# Altium project Battery_4_mI_R2.PrjPcb
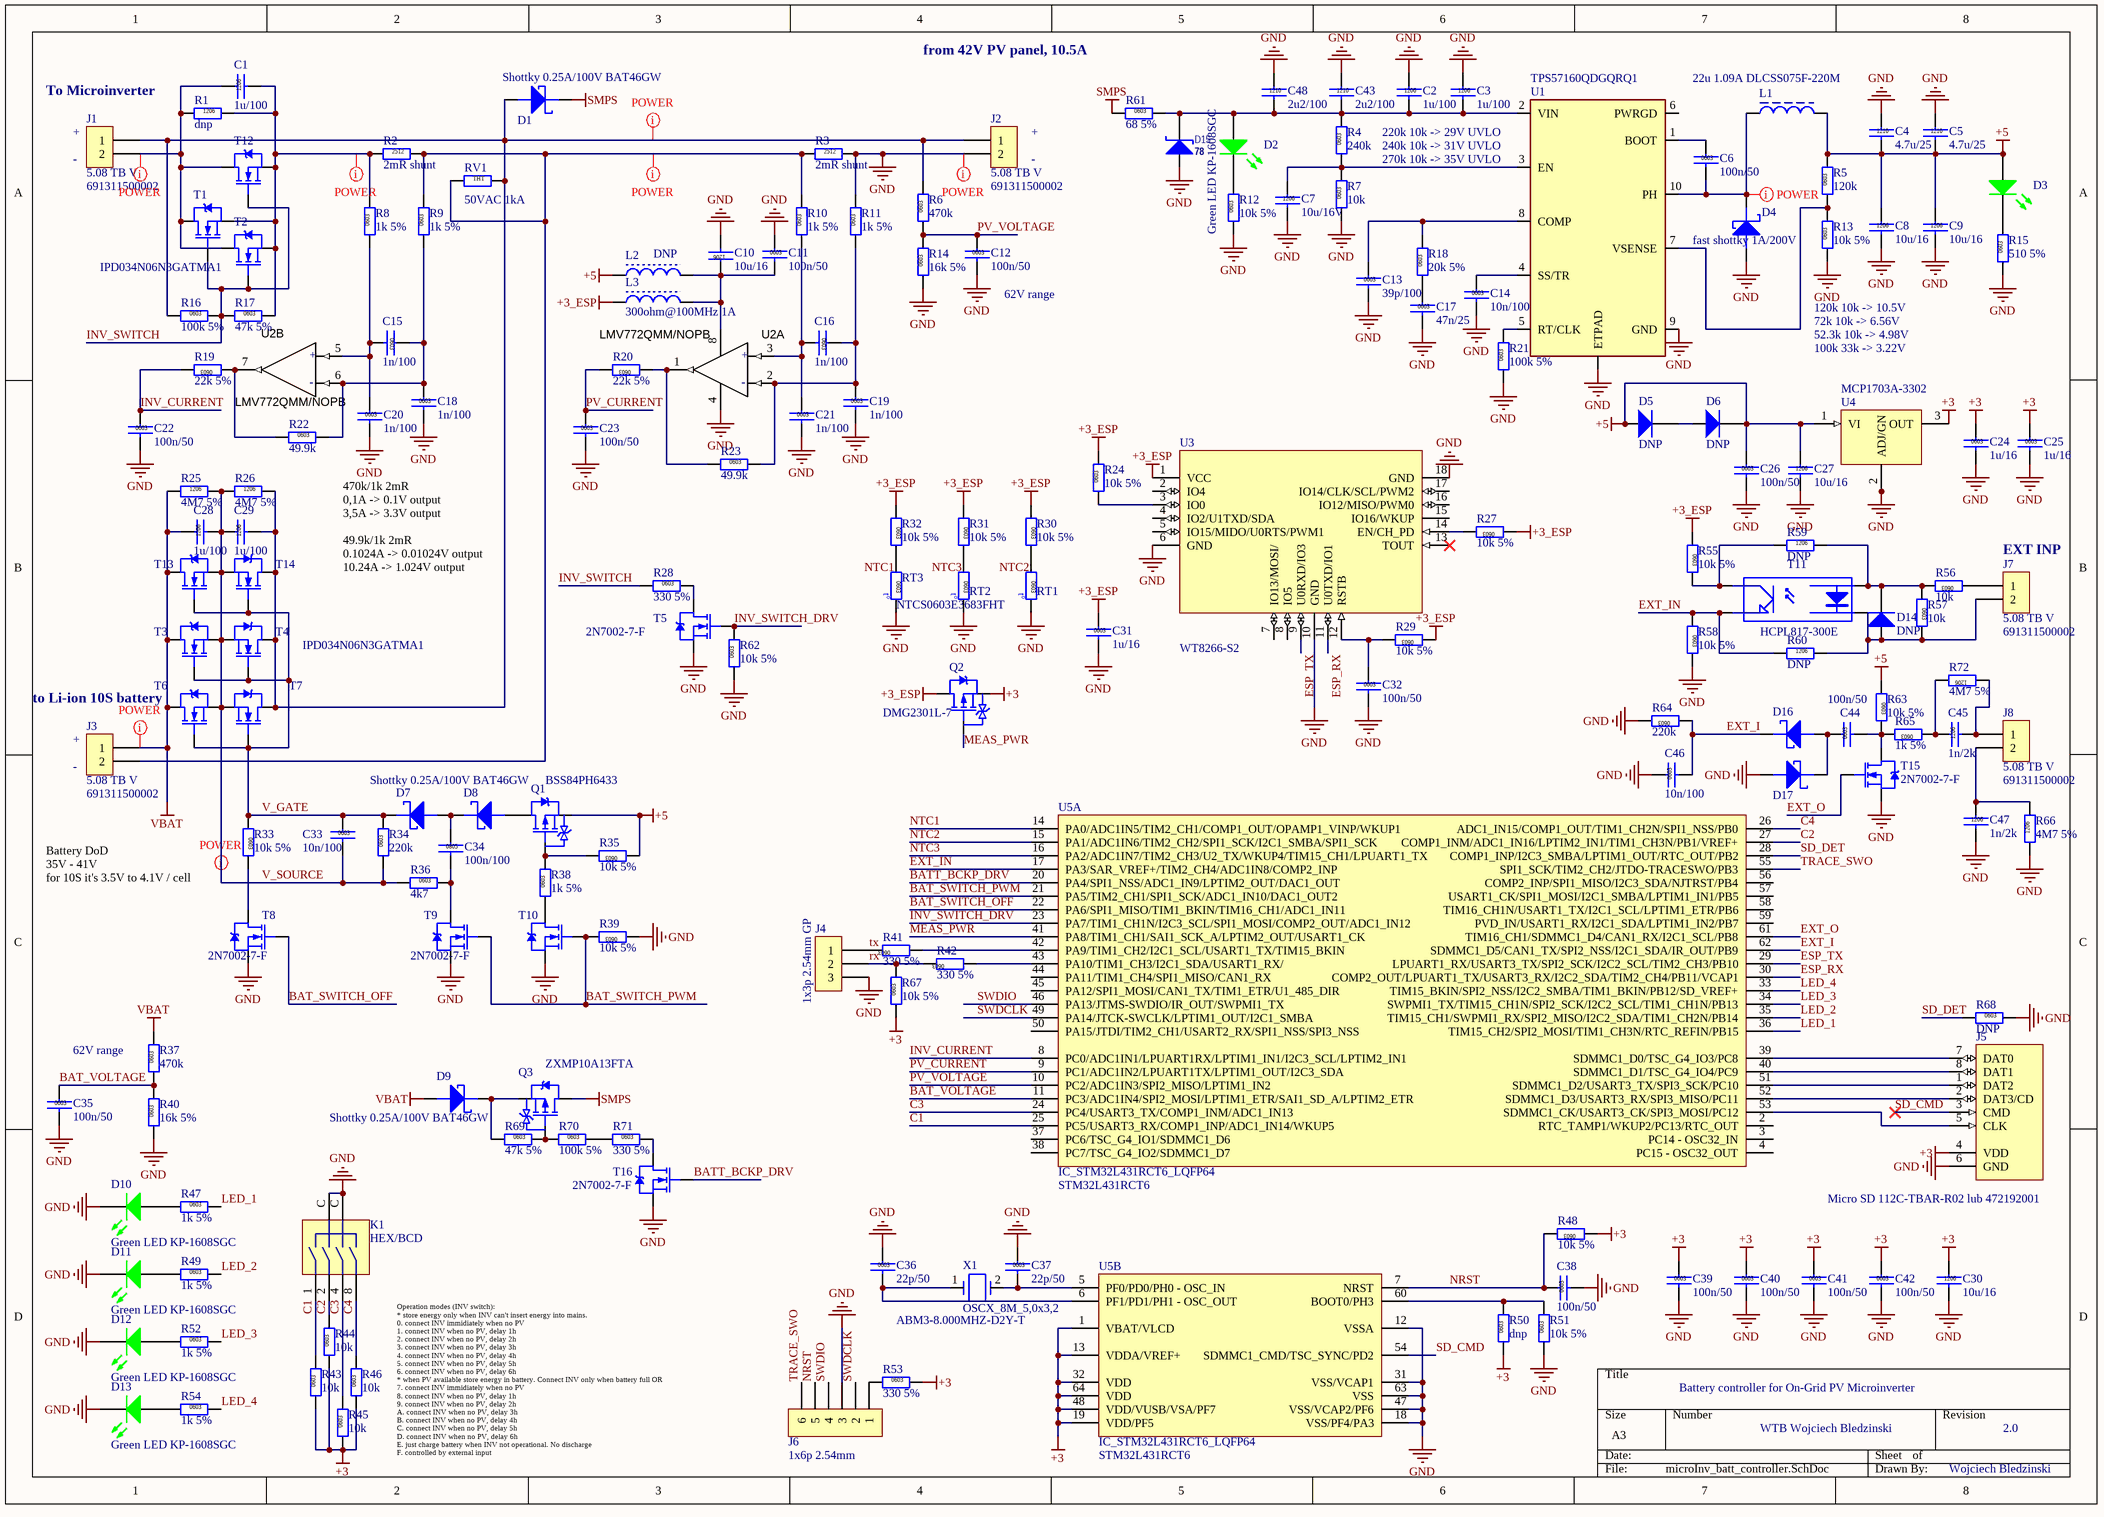
[diagram p0: microInv_batt_controller.SchDoc]
1 sheet, 178 parts. Net scope: global (net labels, ports and power ports of the same name join across sheets).
Board file: microInv_batt_controller.PcbDoc

## Sheet microInv_batt_controller.SchDoc
size A3; SheetNumber: 1; SheetTotal: 3

### Parts
C1  1u/100  [CAP_1206]
C2  1u/100  [CAP_1206]
C3  1u/100  [CAP_1206]
C4  4.7u/25  [CAP_1210]
C5  4.7u/25  [CAP_1210]
C6  100n/50  [CAP_0603]
C7  10u/16V  [CAP_1206]
C8  10u/16  [CAP_1206]
C9  10u/16  [CAP_1206]
C10  10u/16  [CAP_1206]
C11  100n/50  [CAP_0603]
C12  100n/50  [CAP_0603]
C13  39p/100  [CAP_0603]
C14  10n/100  [CAP_0603]
C15  1n/100  [CAP_0603]
C16  1n/100  [CAP_0603]
C17  47n/25  [CAP_0603]
C18  1n/100  [CAP_0603]
C19  1n/100  [CAP_0603]
C20  1n/100  [CAP_0603]
C21  1n/100  [CAP_0603]
C22  100n/50  [CAP_0603]
C23  100n/50  [CAP_0603]
C24  1u/16  [CAP_0603]
C25  1u/16  [CAP_0603]
C26  100n/50  [CAP_0603]
C27  10u/16  [CAP_1206]
C28  1u/100  [CAP_1206]
C29  1u/100  [CAP_1206]
C30  10u/16  [CAP_1206]
C31  1u/16  [CAP_0603]
C32  100n/50  [CAP_0603]
C33  10n/100  [CAP_0603]
C34  100n/100  [CAP_0805]
C35  100n/50  [CAP_0603]
C36  22p/50  [CAP_0603]
C37  22p/50  [CAP_0603]
C38  100n/50  [CAP_0603]
C39  100n/50  [CAP_0603]
C40  100n/50  [CAP_0603]
C41  100n/50  [CAP_0603]
C42  100n/50  [CAP_0603]
C43  2u2/100  [CAP_1210]
C44  100n/50  [CAP_0603]
C45  1n/2k  [CAP_1206]
C46  10n/100  [CAP_0603]
C47  1n/2k  [CAP_1206]
C48  2u2/100  [CAP_1210]
D1  Shottky 0.25A/100V BAT46GW  [SOD_123]
D2  Green LED KP-1608SGC  [LED_0603_GREEN]
D3  Green LED KP-1608SGC  [LED_0603_GREEN]  (value not drawn)
D4  fast shottky 1A/200V  [SMA_DO-214AC]
D5  DNP  [D_MINIMELF]
D6  DNP  [D_MINIMELF]
D7  Shottky 0.25A/100V BAT46GW  [SOD_123]
D8  Shottky 0.25A/100V BAT46GW  [SOD_123]  (value not drawn)
D9  Shottky 0.25A/100V BAT46GW  [SOD_123]
D10  Green LED KP-1608SGC  [LED_0603_GREEN]
D11  Green LED KP-1608SGC  [LED_0603_GREEN]
D12  Green LED KP-1608SGC  [LED_0603_GREEN]
D13  Green LED KP-1608SGC  [LED_0603_GREEN]
D14  DNP  [D_MINIMELF]
D15  78  [SMA_DO-214AC]
D16  Shottky 0.25A/100V BAT46GW  [SOD_123]  (value not drawn)
D17  Shottky 0.25A/100V BAT46GW  [SOD_123]  (value not drawn)
J1  5.08 TB V  Manufacturer Part Number: 691311500002  [CON_1x2_5.08TB]
J2  5.08 TB V  Manufacturer Part Number: 691311500002  [CON_1x2_5.08TB]
J3  5.08 TB V  Manufacturer Part Number: 691311500002  [CON_1x2_5.08TB]
J4  1x3p 2.54mm GP  [CON_PIN1x3_THT]
J5  Micro SD 112C-TBAR-R02 lub 472192001  [112C_TXAR_R01]
J6  1x6p 2.54mm  [CON_PIN1x6_THT]
J7  5.08 TB V  Manufacturer Part Number: 691311500002  [CON_1x2_5.08TB]
J8  5.08 TB V  Manufacturer Part Number: 691311500002  [CON_1x2_5.08TB]
K1  HEX/BCD  [MECH_SW_HEXBCD]
L1  22u 1.09A DLCSS075F-220M  [IND_DER0705]
L2  DNP  [RES_0603]
L3  300ohm@100MHz 1A  [RES_0603]
Q1  BSS84PH6433  [SOT23-3]
Q2  DMG2301L-7  [SOT23-3]
Q3  ZXMP10A13FTA  [SOT23-3]
R1  dnp  [RES_1206]
R2  2mR shunt  [RES_2512_shunt]
R3  2mR shunt  [RES_2512_shunt]
R4  240k  [RES_0603]
R5  120k  [RES_0603]
R6  470k  [RES_0603]
R7  10k  [RES_0603]
R8  1k 5%  [RES_0603]
R9  1k 5%  [RES_0603]
R10  1k 5%  [RES_0603]
R11  1k 5%  [RES_0603]
R12  10k 5%  [RES_0603]
R13  10k 5%  [RES_0603]
R14  16k 5%  [RES_0603]
R15  510 5%  [RES_0603]
R16  100k 5%  [RES_0603]
R17  47k 5%  [RES_0603]
R18  20k 5%  [RES_0603]
R19  22k 5%  [RES_0603]
R20  22k 5%  [RES_0603]
R21  100k 5%  [RES_0603]
R22  49.9k  [RES_0603]
R23  49.9k  [RES_0603]
R24  10k 5%  [RES_0603]
R25  4M7 5%  [RES_1206]
R26  4M7 5%  [RES_1206]
R27  10k 5%  [RES_0603]
R28  330 5%  [RES_0603]
R29  10k 5%  [RES_0603]
R30  10k 5%  [RES_0603]
R31  10k 5%  [RES_0603]
R32  10k 5%  [RES_0603]
R33  10k 5%  [RES_0603]
R34  220k  [RES_0603]
R35  10k 5%  [RES_0603]
R36  4k7  [RES_0603]
R37  470k  [RES_0603]
R38  1k 5%  [RES_0603]
R39  10k 5%  [RES_0603]
R40  16k 5%  [RES_0603]
R41  330 5%  [RES_0603]
R42  330 5%  [RES_0603]
R43  10k  [RES_0603]
R44  10k  [RES_0603]
R45  10k  [RES_0603]
R46  10k  [RES_0603]
R47  1k 5%  [RES_0603]
R48  10k 5%  [RES_0603]
R49  1k 5%  [RES_0603]
R50  dnp  [RES_0603]
R51  10k 5%  [RES_0603]
R52  1k 5%  [RES_0603]
R53  330 5%  [RES_0603]
R54  1k 5%  [RES_0603]
R55  10k 5%  [RES_0603]
R56  10k  [RES_0603]
R57  10k  [RES_0603]
R58  10k 5%  [RES_0603]
R59  DNP  [RES_1206]
R60  DNP  [RES_1206]
R61  68 5%  [RES_0603]
R62  10k 5%  [RES_0603]
R63  10k 5%  [RES_0603]
R64  220k  [RES_0603]
R65  1k 5%  [RES_0603]
R66  4M7 5%  [RES_1206]
R67  10k 5%  [RES_0603]
R68  DNP  [RES_0603]
R69  47k 5%  [RES_0603]
R70  100k 5%  [RES_0603]
R71  330 5%  [RES_0603]
R72  4M7 5%  [RES_1206]
RT1  NTCS0603E3683FHT  [RES_0603]  (value not drawn)
RT2  NTCS0603E3683FHT  [RES_0603]  (value not drawn)
RT3  NTCS0603E3683FHT  [RES_0603]
RV1  50VAC 1kA  [RES_VAR_S14]
T1  IPD034N06N3GATMA1  [DPAK_369C_issueD]
T2  IPD034N06N3GATMA1  [DPAK_369C_issueD]  (value not drawn)
T3  IPD034N06N3GATMA1  [DPAK_369C_issueD]  (value not drawn)
T4  IPD034N06N3GATMA1  [DPAK_369C_issueD]  (value not drawn)
T5  2N7002-7-F  [SOT23-3]
T6  IPD034N06N3GATMA1  [DPAK_369C_issueD]  (value not drawn)
T7  IPD034N06N3GATMA1  [DPAK_369C_issueD]
T8  2N7002-7-F  [SOT23-3]
T9  2N7002-7-F  [SOT23-3]
T10  2N7002-7-F  [SOT23-3]  (value not drawn)
T11  HCPL817-300E  [HCPL-817]
T12  IPD034N06N3GATMA1  [DPAK_369C_issueD]  (value not drawn)
T13  IPD034N06N3GATMA1  [DPAK_369C_issueD]  (value not drawn)
T14  IPD034N06N3GATMA1  [DPAK_369C_issueD]  (value not drawn)
T15  2N7002-7-F  [SOT23-3]
T16  2N7002-7-F  [SOT23-3]
U1  TPS57160QDGQRQ1  [MSOP10_DQG_S_PDSO_G10]
U2  LMV772QMM/NOPB  [MSOP8_3x3_846AD-01]  (parts A,B of 2)
U3  WT8266-S2  [MOD_WT8266-S2]
U4  MCP1703A-3302  [sot223]
U5  IC_STM32L431RCT6_LQFP64  Manufacturer Part Number: STM32L431RCT6  [LQFP64_10x10]  (parts A,B of 2)
X1  OSCX_8M_5,0x3,2  Manufacturer Part Number: ABM3-8.000MHZ-D2Y-T  [X_5.0X3.2]

### Nets
+3: C24.1 C25.1 C30.1 C39.1 C40.1 C41.1 C42.1 J5.4(VDD) Q2.2(S) R43.1 R44.1 R45.1 R46.1 R48.1 R50.1 R53.2 R67.1 U4.3(OUT) U5.1(VBAT/VLCD) U5.13(VDDA/VREF+) U5.19(VDD/PF5) U5.32(VDD) U5.48(VDD/VUSB/VSA/PF7) U5.64(VDD)
+3_ESP: C31.1 L3.1 Q2.3(D) R24.2 R27.1 R29.1 R30.1 R31.1 R32.1 R55.1 U3.1(VCC)
+5: C4.2 C5.2 C8.1 C9.1 C26.1 C27.1 D3.1(A) D5.1(A) D6.2(K) L1.2 L2.1 Q1.2(S) R5.2 R35.1 R63.1 U4.1(VI)
GND: C2.1 C3.1 C4.1 C5.1 C7.2 C8.2 C9.2 C10.2 C11.1 C12.2 C13.2 C14.2 C17.2 C18.2 C19.2 C20.2 C21.2 C22.2 C23.2 C24.2 C25.2 C26.2 C27.2 C30.2 C31.2 C32.2 C35.2 C36.1 C37.1 C38.2 C39.2 C40.2 C41.2 C42.2 C43.1 C46.1 C47.2 C48.1 D4.1(A) D10.2(K) D11.2(K) D12.2(K) D13.2(K) D15.1(A) D17.1(A) J2.2 J4.3 J5.6(GND) J6.3 K1.C R3.2 R7.1 R11.2 R12.1 R13.1 R14.1 R15.1 R21.1 R39.1 R40.1 R51.1 R58.2 R62.1 R64.2 R66.1 R68.2 RT1.2 RT2.2 RT3.2 T5.2(S) T8.2(S) T9.2(S) T10.2(S) T15.2(S) T16.2(S) U1.9(GND) U1.11(ETPAD) U2.4(-V) U3.6(GND) U3.10(GND) U3.18(GND) U4.2(ADJ/GN) U4.4 U5.12(VSSA) U5.18(VSS/PF4/PA3) U5.31(VSS/VCAP1) U5.47(VSS/VCAP2/PF6) U5.63(VSS)
SMPS: D1.2(K) Q3.3(D) R61.1
VBAT: C28.1 D9.1(A) J3.1 R25.1 R37.2 T3.4(D) T6.4(D) T13.4(D)
BAT_SWITCH_OFF: T8.1(G) U5.22(PA6/SPI1_MISO/TIM1_BKIN/TIM16_CH1/ADC1_IN11)
BAT_SWITCH_PWM: R39.2 T9.1(G) T10.1(G) U5.21(PA5/TIM2_CH1/SPI1_SCK/ADC1_IN10/DAC1_OUT2)
BAT_VOLTAGE: C35.1 R37.1 R40.2 U5.11(PC3/ADC1IN4/SPI2_MOSI/LPTIM1_ETR/SAI1_SD_A/LPTIM2_ETR)
BATT_BCKP_DRV: T16.1(G) U5.20(PA4/SPI1_NSS/ADC1_IN9/LPTIM2_OUT/DAC1_OUT)
C1: K1.1 R43.2 U5.25(PC5/USART3_RX/COMP1_INP/ADC1_IN14/WKUP5)
C2: K1.2 R44.2 U5.27(COMP1_INM/ADC1_IN16/LPTIM2_IN1/TIM1_CH3N/PB1/VREF+)
C3: K1.4 R45.2 U5.24(PC4/USART3_TX/COMP1_INM/ADC1_IN13)
C4: K1.8 R46.2 U5.26(ADC1_IN15/COMP1_OUT/TIM1_CH2N/SPI1_NSS/PB0)
ESP_RX: U3.11(U0TXD/IO1) U5.30(COMP2_OUT/LPUART1_TX/USART3_RX/I2C2_SDA/TIM2_CH4/PB11/VCAP1)
ESP_TX: U3.9(U0RXD/IO3) U5.29(LPUART1_RX/USART3_TX/SPI2_SCK/I2C2_SCL/TIM2_CH3/PB10)
EXT_I: C46.2 D16.2(K) R64.1 U5.62(SDMMC1_D5/CAN1_TX/SPI2_NSS/I2C1_SDA/IR_OUT/PB9)
EXT_IN: R58.1 R60.1 T11.3(E) U5.17(PA3/SAR_VREF+/TIM2_CH4/ADC1IN8/COMP2_INP)
EXT_O: T15.1(G) U5.61(TIM16_CH1/SDMMC1_D4/CAN1_RX/I2C1_SCL/PB8)
INV_CURRENT: C22.1 R19.2 U5.8(PC0/ADC1IN1/LPUART1RX/LPTIM1_IN1/I2C3_SCL/LPTIM2_IN1)
INV_SWITCH: R16.2 R17.1 R28.1 T1.1(G) T2.1(G) T12.1(G)
INV_SWITCH_DRV: R62.2 T5.1(G) U5.23(PA7/TIM1_CH1N/I2C3_SCL/SPI1_MOSI/COMP2_OUT/ADC1_IN12)
LED_1: R47.2 U5.36(TIM15_CH2/SPI2_MOSI/TIM1_CH3N/RTC_REFIN/PB15)
LED_2: R49.2 U5.35(TIM15_CH1/SWPMI1_RX/SPI2_MISO/I2C2_SDA/TIM1_CH2N/PB14)
LED_3: R52.2 U5.34(SWPMI1_TX/TIM15_CH1N/SPI2_SCK/I2C2_SCL/TIM1_CH1N/PB13)
LED_4: R54.2 U5.33(TIM15_BKIN/SPI2_NSS/I2C2_SMBA/TIM1_BKIN/PB12/SD_VREF+)
MEAS_PWR: Q2.1(G) U5.41(PA8/TIM1_CH1/SAI1_SCK_A/LPTIM2_OUT/USART1_CK)
NRST: C38.1 J6.5 R48.2 U5.7(NRST)
NTC1: R32.2 RT3.1 U5.14(PA0/ADC1IN5/TIM2_CH1/COMP1_OUT/OPAMP1_VINP/WKUP1)
NTC2: R30.2 RT1.1 U5.15(PA1/ADC1IN6/TIM2_CH2/SPI1_SCK/I2C1_SMBA/SPI1_SCK)
NTC3: R31.2 RT2.1 U5.16(PA2/ADC1IN7/TIM2_CH3/U2_TX/WKUP4/TIM15_CH1/LPUART1_TX)
PV_CURRENT: C23.1 R20.2 U5.9(PC1/ADC1IN2/LPUART1TX/LPTIM1_OUT/I2C3_SDA)
PV_VOLTAGE: C12.1 R6.1 R14.2 U5.10(PC2/ADC1IN3/SPI2_MISO/LPTIM1_IN2)
rx: J4.2 R42.1 R67.2
SD_CMD: J5.3(CMD) U5.54(SDMMC1_CMD/TSC_SYNC/PD2)
SD_DET: R68.1 U5.28(COMP1_INP/I2C3_SMBA/LPTIM1_OUT/RTC_OUT/PB2)
SWDCLK: J6.2 U5.49(PA14/JTCK-SWCLK/LPTIM1_OUT/I2C1_SMBA)
SWDIO: J6.4 U5.46(PA13/JTMS-SWDIO/IR_OUT/SWPMI1_TX)
TRACE_SWO: J6.6 U5.55(SPI1_SCK/TIM2_CH2/JTDO-TRACESWO/PB3)
tx: J4.1 R41.1
V_GATE: C33.1 D7.2(K) R33.1 R34.2 T3.1(G) T4.1(G) T6.1(G) T7.1(G) T13.1(G) T14.1(G)
V_SOURCE: C28.2 C29.1 C33.2 R25.2 R26.1 R34.1 R36.1 T3.3(S) T4.3(S) T6.3(S) T7.3(S) T13.3(S) T14.3(S)
NetC1_1: C1.1 J1.2 R1.1 T1.4(D) T2.4(D) T12.4(D)
NetC1_2: C1.2 R1.2 R2.1 R8.2 R17.2 T1.3(S) T2.3(S) T12.3(S)
NetC2_2: C2.2 C3.2 C43.2 C48.2 D2.1(A) D15.2(K) R4.2 R61.2 U1.2(VIN)
NetC6_1: C6.1 U1.1(BOOT)
NetC6_2: C6.2 D4.2(K) L1.1 U1.10(PH)
NetC7_1: C7.1 R4.1 R7.2 U1.3(EN)
NetC10_1: C10.1 C11.2 L2.2 L3.2 U2.8(+V)
NetC13_1: C13.1 R18.2 U1.8(COMP)
NetC14_1: C14.1 U1.4(SS/TR)
NetC15_1: C15.1 C18.1 R9.1 R22.2 U2.6(-)
NetC15_2: C15.2 C20.1 R8.1 U2.5(+)
NetC16_1: C16.1 C19.1 R11.1 R23.2 U2.2(-)
NetC16_2: C16.2 C21.1 R10.1 U2.3(+)
NetC17_1: C17.1 R18.1
NetC29_2: C29.2 D1.1(A) J1.1 J2.1 R6.2 R16.1 R26.2 RV1.2 T4.4(D) T7.4(D) T14.4(D)
NetC32_1: C32.1 R29.2 U3.12(RSTB)
NetC34_1: C34.1 D7.1(A) D8.2(K)
NetC34_2: C34.2 R36.2 T9.3(D)
NetC36_2: C36.2 U5.6(PF1/PD1/PH1_-_OSC_OUT) X1.1
NetC37_2: C37.2 U5.5(PF0/PD0/PH0_-_OSC_IN) X1.2
NetC44_1: C44.1 D16.1(A) D17.2(K)
NetC44_2: C44.2 R63.2 R65.2 T15.3(D)
NetC45_1: C45.1 R65.1 R72.2
NetC45_2: C45.2 J8.1 R72.1
NetC47_1: C47.1 J8.2 R66.2
NetD2_2: D2.2(K) R12.2
NetD3_2: D3.2(K) R15.2
NetD5_2: D5.2(K) D6.1(A)
NetD8_1: D8.1(A) Q1.3(D)
NetD9_2: D9.2(K) Q3.2(S) R69.1
NetD10_1: D10.1(A) R47.1
NetD11_1: D11.1(A) R49.1
NetD12_1: D12.1(A) R52.1
NetD13_1: D13.1(A) R54.1
NetD14_1: D14.1(A) J7.2 R57.2 R60.2 T11.2(K)
NetD14_2: D14.2(K) R56.2 R57.1 R59.2 T11.1(A)
NetJ3_2: J3.2 R2.2 R3.1 R9.2 R10.2 RV1.1
NetJ5_1: J5.1(DAT2) U5.51(SDMMC1_D2/USART3_TX/SPI3_SCK/PC10)
NetJ5_2: J5.2(DAT3/CD) U5.52(SDMMC1_D3/USART3_RX/SPI3_MISO/PC11)
NetJ5_5: J5.5(CLK) U5.53(SDMMC1_CK/USART3_CK/SPI3_MOSI/PC12)
NetJ5_7: J5.7(DAT0) U5.39(SDMMC1_D0/TSC_G4_IO3/PC8)
NetJ5_8: J5.8(DAT1) U5.40(SDMMC1_D1/TSC_G4_IO4/PC9)
NetJ6_1: J6.1 R53.1
NetJ7_1: J7.1 R56.1
NetQ1_1: Q1.1(G) R35.2 R38.2
NetQ3_1: Q3.1(G) R69.2 R70.1
NetR5_1: R5.1 R13.2 U1.7(VSENSE)
NetR19_1: R19.1 R22.1 U2.7(O)
NetR20_1: R20.1 R23.1 U2.1(O)
NetR21_2: R21.2 U1.5(RT/CLK)
NetR24_1: R24.1 U3.3(IO0)
NetR27_2: R27.2 U3.14(EN/CH_PD)
NetR28_2: R28.2 T5.3(D)
NetR33_2: R33.2 T8.3(D)
NetR38_1: R38.1 T10.3(D)
NetR41_2: R41.2 U5.42(PA9/TIM1_CH2/I2C1_SCL/USART1_TX/TIM15_BKIN)
NetR42_2: R42.2 U5.43(PA10/TIM1_CH3/I2C1_SDA/USART1_RX/)
NetR50_2: R50.2 R51.2 U5.60(BOOT0/PH3)
NetR55_2: R55.2 R59.1 T11.4(C)
NetR70_2: R70.2 R71.1
NetR71_2: R71.2 T16.3(D)

Not connected (* = marked no-connect by the designer): U1 6(PWRGD); U3 2(IO4) 4(IO2/U1TXD/SDA) 5(IO15/MIDO/U0RTS/PWM1) 7(IO13/MOSI/) 8(IO5) 13(TOUT)* 15(IO16/WKUP) 16(IO12/MISO/PWM0) 17(IO14/CLK/SCL/PWM2); U5 2(RTC_TAMP1/WKUP2/PC13/RTC_OUT) 3(PC14_-_OSC32_IN) 4(PC15_-_OSC32_OUT) 37(PC6/TSC_G4_IO1/SDMMC1_D6) 38(PC7/TSC_G4_IO2/SDMMC1_D7) 44(PA11/TIM1_CH4/SPI1_MISO/CAN1_RX) 45(PA12/SPI1_MOSI/CAN1_TX/TIM1_ETR/U1_485_DIR) 50(PA15/JTDI/TIM2_CH1/USART2_RX/SPI1_NSS/SPI3_NSS) 56(COMP2_INP/SPI1_MISO/I2C3_SDA/NJTRST/PB4) 57(USART1_CK/SPI1_MOSI/I2C1_SMBA/LPTIM1_IN1/PB5) 58(TIM16_CH1N/USART1_TX/I2C1_SCL/LPTIM1_ETR/PB6) 59(PVD_IN/USART1_RX/I2C1_SDA/LPTIM1_IN2/PB7)

### Layout directives
net class POWER: GND, NetC1_1, NetC1_2, NetC6_2, NetC29_2, NetJ3_2, V_SOURCE, VBAT

### Notes on the sheet
- To Microinverter
- from 42V PV panel, 10.5A
- (near J1) +
- (near J1) -
- (near J2) +
- (near J2) -
- 240k 10k -> 31V UVLO
- 270k 10k -> 35V UVLO
- 220k 10k -> 29V UVLO
- (near C12) 62V range
- 120k 10k -> 10.5V
- 52.3k 10k -> 4.98V
- 72k 10k -> 6.56V
- 100k 33k -> 3.22V
- 470k/1k 2mR
  0,1A -> 0.1V output
  3,5A -> 3.3V output
  49.9k/1k 2mR
  0.1024A -> 0.01024V output
  10.24A -> 1.024V output
- (near J7) EXT INP
- (near T6) to Li-ion 10S battery
- (near J3) +
- (near J3) -
- Battery DoD
  35V - 41V
  for 10S it's 3.5V to 4.1V / cell
- 62V range
- Battery controller for On-Grid PV Microinverter
- Operation modes (INV switch):
  * store energy only when INV can't insert energy into mains.
  0. connect INV immidiately when no PV
  1. connect INV when no PV, delay 1h
  2. connect INV when no PV, delay 2h
  3. connect INV when no PV, delay 3h
  4. connect INV when no PV, delay 4h
  5. connect INV when no PV, delay 5h
  6. connect INV when no PV, delay 6h
  * when PV available store energy in battery. Connect INV only when battery full OR
  7. connect INV immidiately when no PV
  8. connect INV when no PV, delay 1h
  9. connect INV when no PV, delay 2h
  A. connect INV when no PV, delay 3h
  B. connect INV when no PV, delay 4h
  C. connect INV when no PV, delay 5h
  D. connect INV when no PV, delay 6h
  E. just charge battery when INV not operational. No discharge
  F. controlled by external input
- WTB Wojciech Bledzinski
- 2.0
- Wojciech Bledzinski
- (in symbol CAP_B_1n_2k_1206_X7R) 1206
- (in symbol CAP_B_1n_100_0603_X7R) 0603
- (in symbol CAP_B_1u_16_0603_X7R) 0603
- (in symbol CAP_B_1u_100_1206_X7R) 1206
- (in symbol CAP_B_2u2_100_1210_X7R) 1210
- (in symbol CAP_B_4.7u_25_1210_X5R) 1210
- (in symbol CAP_B_10n_100_0603_X7R) 0603
- (in symbol CAP_B_10u_16_1206_X7R) 1206
- (in symbol CAP_B_10u_25_1206_X5R) 1206
- (in symbol CAP_B_22p_50_0603_X7R) 0603
- (in symbol CAP_B_39p_100_0603_COG) 0603
- (in symbol CAP_B_47n_25_0603_X7R) 0603
- (in symbol CAP_B_100n_50_0603_X7R) 0603
- (in symbol CAP_B_100n_100_0805_X7R) 0805
- (in symbol RES_0R_5p_1206) 1206
- (in symbol RES_1k_5p_0603) 0603
- (in symbol RES_2mR_1p_2512) 2512
- (in symbol RES_4M7_5p_1206) 1206
- (in symbol RES_10k_5p_0603) 0603
- (in symbol RES_16k_5p_0603) 0603
- (in symbol RES_20k_5p_0603) 0603
- (in symbol RES_22k_5p_0603) 0603
- (in symbol RES_47k_5p_0603) 0603
- (in symbol RES_62k_5p_0603) 0603
- (in symbol RES_68_5p_0603) 0603
- (in symbol RES_100k_5p_0603) 0603
- (in symbol RES_105k_5p_0603) 0603
- (in symbol RES_330R_5p_0603) 0603
- (in symbol RES_510_5p_0603) 0603
- (in symbol REST_10k_0603) 0603; t°

### Library data of the parts
C1-C3 C28 C29 = CAP_B_1u_100_1206_X7R: X7R chip capacitor; Manufacturer: AVX; Manufacturer Part Number: 12061C105KAT2A; Eng.: W.Bledzinski 12.06.2014; Tolerance: 10%; Type: SMD; Voltage: 100; Category: CAP; Price1k: 0.2; Price10: 0.22; Supplier: TME; Supplier Part Number: 12061C105KAT2A; Temperature: -55 to + 125 stC; Value: 1u/100; Supplier 1: FARNELL; Supplier Part Number 1: 2112837
C4 C5 = CAP_B_4.7u_25_1210_X5R: X5R chip capacitor; Manufacturer: YAGEO; Manufacturer Part Number: CC1210KKX5R8BB475; Eng.: W.Bledzinski 14.05.2014; Tolerance: 10%; Type: SMD; Voltage: 25; Category: CAP; Price1k: 0.007; Price10: 0.17; Supplier: TME; Supplier Part Number: CC1210KKX5R8475; Temperature: -55 to + 125 stC; Value: 4.7u/25; Supplier 1: Farnell; Supplier Part Number 1: 1833828
C6 C11 C12 C22 C23 C26 C32 C35 C38-C42 C44 = CAP_B_100n_50_0603_X7R: X7R chip capacitor; Manufacturer: SAMSUNG; Manufacturer Part Number: CL10B104KB8NNNC; Eng.: W.Bledzinski 23.5.2013; Tolerance: 10%; Type: SMD; Voltage: 50; Category: CAP; Price1k: 0.006; Price10: 0.1; Supplier: TME; Supplier Part Number: CL10B104KB8NNNC; Temperature: -55 to + 125 stC; Value: 100n/50
C7 = CAP_B_10u_25_1206_X5R: X5R chip capacitor; Manufacturer: SAMSUNG; Manufacturer Part Number: CL31A106KAHNNNE; Eng.: W.Bledzinski 23.10.2014; Tolerance: 10%; Type: SMD; Value: 10u/25; Voltage: 25; Category: CAP; Price1k: 0.045; Price10: 0.08; Supplier: TME; Supplier Part Number: CL31A106KAHNNNE; Temperature: -55 to + 85 stC; Supplier 1: Farnell; Supplier Part Number 1: 2426961
C8-C10 C27 C30 = CAP_B_10u_16_1206_X7R: X7R chip capacitor; Manufacturer: KYOCERA; Manufacturer Part Number: CM316X7R106K16AT; Eng.: W.Bledzinski 12.06.2014; Tolerance: 10%; Type: SMD; Voltage: 16; Category: CAP; Price1k: 0.045; Price10: 0.08; Supplier: TME; Supplier Part Number: CM316X7R106K16AT; Temperature: -55 to + 125 stC; Value: 10u/16; Supplier 1: Farnell; Supplier Part Number 1: 2070502
C13 = CAP_B_39p_100_0603_COG: COG chip capacitor; Eng.: W.Bledzinski 12.06.2015; Tolerance: 10%; Type: SMD; Voltage: 100; Category: CAP; Price1k: 0.006; Price10: 0.1; Supplier: TME; Temperature: -55 to + 125 stC; Value: 39p/100; Supplier 1: Farnell
C14 C33 C46 = CAP_B_10n_100_0603_X7R: X7R chip capacitor; Manufacturer: SAMSUNG; Manufacturer Part Number: CL10B103KC8NNNC; Eng.: W.Bledzinski 08.05.2014; Tolerance: 10%; Type: SMD; Voltage: 100; Category: CAP; Price1k: 0.0027; Price10: 0.01; Supplier: TME; Supplier Part Number: CL10B103KC8NNNC; Temperature: -55 to + 125 stC; Value: 10n/100; Supplier 1: Farnell; Supplier Part Number 1: 1327671
C15 C16 C18-C21 = CAP_B_1n_100_0603_X7R: X7R chip capacitor; Manufacturer: SAMSUNG; Manufacturer Part Number: CL10B102KC8NNNC; Eng.: W.Bledzinski 30.04.2014; Tolerance: 10%; Type: SMD; Voltage: 100; Category: CAP; Price1k: 0.006; Price10: 0.1; Supplier: TME; Supplier Part Number: CL10B102KC8NNNC; Temperature: -55 to + 125 stC; Value: 1n/100; Supplier 1: Farnell; Supplier Part Number 1: 1833874
C17 = CAP_B_47n_25_0603_X7R: X7R chip capacitor; Tolerance: 10%; Type: SMD; Voltage: 25; Category: CAP; Supplier: TME; Temperature: -55 to + 125 stC; Value: 47n/25; Supplier 1: Farnell
C24 C25 C31 = CAP_B_1u_16_0603_X7R: X7R chip capacitor; Manufacturer: SAMSUNG; Manufacturer Part Number: CL10B105KO8NNNC; Eng.: W.Bledzinski 23.5.2013; Tolerance: 10%; Type: SMD; Voltage: 16; Category: CAP; Price1k: 0.012; Price10: 0.1; Supplier: TME; Supplier Part Number: CL10B105KO8NNNC; Temperature: -55 to + 125 stC; Value: 1u/16; Supplier 1: Farnell; Supplier Part Number 1: 2310404
C34 = CAP_B_100n_100_0805_X7R: X7R chip capacitor; Manufacturer: AVX; Manufacturer Part Number: 08051C104KAZ2A; Eng.: W.Bledzinski 12.06.2014; Tolerance: 10%; Type: SMD; Voltage: 100; Category: CAP; Price1k: 0.03; Price10: 0.1; Supplier: TME; Supplier Part Number: 08051C104KAZ2A; Temperature: -55 to + 85 stC; Value: 100n/100; Supplier 1: FARNELL; Supplier Part Number 1: 1301805
C36 C37 = CAP_B_22p_50_0603_X7R: X7R chip capacitor; Tolerance: 10%; Type: SMD; Voltage: 50; Price1k: 0.0027; Price10: 0.01; Supplier: TME; Temperature: -55 to + 125 stC; Value: 22p/50; Supplier 1: Farnell
C43 C48 = CAP_B_2u2_100_1210_X7R: X7R chip capacitor; Manufacturer: KEMET; Manufacturer Part Number: C1210C225M1RACTU; Eng.: W.Bledzinski 12.06.2014; Tolerance: 10%; Type: SMD; Voltage: 100; Category: CAP; Price1k: 0.35; Price10: 0.55; Supplier: TME; Supplier Part Number: CL32B225KCJSNNE; Temperature: -55 to + 125 stC; Value: 2u2/100; Supplier 1: FARNELL; Supplier Part Number 1: 1838747
C45 C47 = CAP_B_1n_2k_1206_X7R: X7R chip capacitor; Manufacturer: MULTICOMP; Manufacturer Part Number: MC1206B102K202CT; Eng.: W.Bledzinski 7.6.2013; Tolerance: 10%; Type: SMD; Voltage: 2k; Category: CAP; Price1k: 0.02; Price10: 0.3; Supplier: FARNELL; Supplier Part Number: 1875512; Temperature: -55 to + 125 stC; Value: 1n/2k; Supplier 1: FARNELL; Supplier Part Number 1: 1875512
D1 D7-D9 D16 D17 = D_0.25_100_BAT46GWX: Shottky Diode trr 4ns 0,43V @ 0.05A 0.75V@0.25A; Manufacturer: Nexperia; Manufacturer Part Number: BAT46GWX 934070363115; Current: 250mA; Type: SMD; Voltage: 100; Category: DIODE; Price1k: 0.04; Price10: 0.062; Supplier: TME; Supplier Part Number: BAT46GWX; Temperature: -55 to +150 stC; Value: Shottky 0.25A/100V BAT46GW; Supplier 1: FARNELL; Supplier Part Number 1: 2760404
D2 D3 D10-D13 = D_LED_0603_GREEN: Diode LED SMD 2.2V @ 20mA 15mcd; Manufacturer: KINGBRIGHT; Eng.: W.Bledzinski 22.5.2013; Voltage: 5; Category: LED; Current: 20mA; Manufacturer Part Number: KP-1608SGC; Price1k: 0.03; Price10: 0.05; Supplier: TME; Supplier Part Number: KP-1608SGC; Temperature: -40 to +85 stC; Type: SMD; Value: Green LED KP-1608SGC; Supplier 1: Farnell; Supplier Part Number 1: 8529833
D4 = D_1A_200_ES1D: Shottky Diode 0,9V @ 1A trr=15ns 7pF; Manufacturer: FAIRCHILD; Manufacturer Part Number: ES1D; Current: 1; Eng.: W.Bledzinski 11.04.2014; Type: SMD; Voltage: 200; Category: DIODE; Price1k: 0.06; Price10: 0.41; Supplier: TME; Supplier Part Number: ES1D; Temperature: -50 to + 150 stC; Value: fast shottky 1A/200V; Supplier 1: FARNELL; Supplier Part Number 1: 1467489
D5 D6 D14 = D_LL4148_MMELF: Manufacturer: ON SEMICONDUCTOR (FAIRCHILD); Manufacturer Part Number: FDLL4148; Type: SMD; Max. off-state voltage: 100V; Max. forward impulse current: 2A; Max. load current: 0.5A; Load current: 0.15A; Forward voltage at If: 1.1V; Category: DIODE; Pricing: 50=0.0128, 250=0.0113, 1000=0.0092, 5000=0.0078, 20000=0.0074 (USD); Supplier 1: TME; Supplier Part Number 1: FDLL4148
D15 = D_TR_UNI_SMAJ78A: transil jednostronny 400W; Manufacturer: MULTICOMP; Current: 3.2A; Eng.: W.Bledzinski 11.06.2014; Type: SMD; Value: Transil_U_400W; Category: DIODE; Manufacturer Part Number: SMAJ78A; Price1k: 0.1; Price10: 0.2; Supplier: TME; Supplier Part Number: SMAJ78A-LF; Temperature: -40 to + 150 stC; Voltage: 78; Supplier 1: Farnell; Supplier Part Number 1: 1579024
J1-J3 J7 J8 = CON_1x2_TB_5.08V: THT 5,08mm, WE 691311500002 (rev1), NINIGI , MLX; Manufacturer: Wurth Electronics; Pitch: 0.200" (5.08mm); Current: 20A; Supplier Unit Price 1: $0.33; Supplier 1: TME; Supplier 2: Digi-Key; Supplier Part Number 1: TBG-5-PB-2P/GN; Supplier Part Number 2: 732-2052-ND
J4 = CON_1x3_GP_THT: THT 2,54 goldpin; Manufacturer: TME; Manufacturer Part Number: ZL201-03G; Manufacturer2 Part Number: MX-90120-0123; Current: 3A; Eng.: W.Bledzinski 14.11.2013; Category: CONN; Price1k: 0.1; Price10: 0.15; Supplier: TME; Supplier Part Number: ZL201-03G; Temperature: -55 to +125 stC; Type: THT; Value: 1x3p 2.54mm GP; Manufacturer2: MOLEX; Supplier 1: digi-key; Supplier Part Number 1: WM8073-ND
J5 = CON_MicroSD: Micro SD connector SMD, ATTEND 112C-TBAR-R02; MOLEX 472192001; Eng.: W.Bledzinski 17.5.2013; Category: CONN; Manufacturer: ATTEND; Manufacturer Part Number: 112C-TBAR-R02; Price1k: 0.65; Price10: 0.8; Supplier: TME; Supplier Part Number: MCC-SDMICRO/1; Temperature: -25 to +85 stC; Type: SMD; Value: Micro SD 112C-TBAR-R02 lub 472192001; Supplier 1: TME; Supplier Part Number 1: MCC-SDMICRO/1
J6 = CON_1x6_GP_THT: THT 2,54 goldpin; Manufacturer: CONNFLY; Manufacturer Part Number: DS1021-1*6SF1-1; Manufacturer2 Part Number: ZL201-06G; Current: 3A; Eng.: W.Bledzinski 02.09.2013; Category: CONN; Price1k: 0.1; Price10: 0.15; Supplier: TME; Supplier Part Number: ZL201-06G; Temperature: -55 to +125 stC; Type: THT; Value: 1x6p 2.54mm; Manufacturer2: TME; Supplier 1: TME; Supplier Part Number 1: ZL201-06G
K1 = MECH_SW_HEXBCD: Zadajnik kodu; Manufacturer: ECE; Manufacturer Part Number: ERD116RSZ; Current: 100mA; Eng.: W.Bledzinski 22.04.2014; Voltage: 200V; Price1k: 1.8; Price10: 2.7; Supplier: TME; Supplier Part Number: ERD116RSZ; Temperature: -40 to + 85 stC; Type: THT; Value: HEX/BCD; Supplier 1: TME; Supplier Part Number 1: ERD116RSZ; Category: SWITCH
L1 = IND_22u_1.09A_DER0705-22: shielded power inductor 1.09A Rdc=0,12; Manufacturer: FERROCORE; Current: 1.09; Eng.: W.Bledzinski 16.06.2014; Tolerance: 20%; Type: SMD; Category: IND; Manufacturer Part Number: DER0705-22; Price1k: 0.4; Price10: 0.45; Supplier: MARITEX; Supplier Part Number: DLCSS075F-220M; Temperature: -40 to + 85 stC; Value: 22u 1.09A DLCSS075F-220M; Supplier 1: TME; Supplier Part Number 1: DER0705-22
L2 = IND_FB_300R_0603: 2A Rdc=0,15 SRF 250MHz; Manufacturer: WE; Manufacturer Part Number: 742792641; Current: 2; Eng.: W.Bledzinski 22.5.2013; Tolerance: 25%; Type: SMD; Value: 300ohm@100MHz 1A; Category: IND; Price1k: .08; Price10: .21; Supplier: FARNELL; Supplier Part Number: 1635705RL; Temperature: -40 to + 125 stC; Supplier 1: FARNELL; Supplier Part Number 1: 1635705
L3 = IND_FB_300R_0603: 2A Rdc=0,15 SRF 250MHz; Manufacturer: WE; Manufacturer Part Number: 742792641; Current: 2; Eng.: W.Bledzinski 22.5.2013; Tolerance: 25%; Type: SMD; Category: IND; Price1k: .08; Price10: .21; Supplier: FARNELL; Supplier Part Number: 1635705RL; Temperature: -40 to + 125 stC; Value: 300ohm@100MHz 1A; Supplier 1: FARNELL; Supplier Part Number 1: 1635705
Q1 = T_BSS84: 50V 130mA P Mosfet; Manufacturer: INFINEON TECHNOLOGIES; Drain-source voltage: -60V; Gate-source voltage: ±20V; Drain current: -140mA; On-state resistance: 8-12Ω @ 4.5V, 5-8Ω @ 10V; Power: 360mW; Vgs(th) (Max) @ Id: 2V @ 20µA; Rds On (Max) @ Id, Vgs: 8 Ohm @ 170mA, 10V; Input Capacitance (Ciss) (Max) @ Vds: 19pF @ 25V; Gate Charge (Qg) (Max) @ Vgs: 1.5nC @ 10V; Drive Voltage (Max Rds On,  Min Rds On): 4.5V, 10V; Pd - Power Dissipation: 300 mW; Supplier 1: TME; Manufacturer Part Number: BSS84PH6433; Pricing: 25=0.0345, 100=0.031, 500=0.0274, 2500=0.0246, 10000=0.023 (USD); Supplier Part Number 1: BSS84PH6433; Operating Temperature: -55°C ~ 150°C (TJ)
Q2 = T_DMG2301L-7: 20V 3A P Mosfet; Manufacturer: DIODES; Drain-source voltage: -20V; Drain current: -3A; Supplier 1: FARNELL; Gate-source voltage: ±20V; Manufacturer Part Number: DMG2301L-7; Supplier Part Number 1: 3127313; Operating Temperature: -55°C ~ 150°C (TJ)
Q3 = T_ZXMP10A13FTA: 100V 700mA P Mosfet; Manufacturer: DIODES; Drain-source voltage: -100V; Gate-source voltage: ±20V; Drain current: -700mA; Supplier 1: FARNELL; Manufacturer Part Number: ZXMP10A13FTA; Supplier Part Number 1: 1843777; Operating Temperature: -55°C ~ 150°C (TJ)
R1 R59 R60 = RES_0R_5p_1206: Resistor 1206 5% 0,25W; Manufacturer: ROYAL OHM; Manufacturer Part Number: 1206S4J0000T5E; Eng.: W.Bledzinski 03.06.2014; Value: 0R 5%; Voltage: 200; Current: 2A/4A; Category: RES; Price1k: 0.24; Price10: 0.3; Supplier: TME; Supplier Part Number: SMD1206-0R; Temperature: -55 to + 125 stC; Tolerance: 5%; Type: SMD; Supplier 1: Farnell; Supplier Part Number 1: 9336974
R2 R3 = RES_2mR_1p_2512: Resistor 2512 5% 1W; Manufacturer: YAGEO; Eng.: W.Bledzinski 11.04.2014; Voltage: 200V/500V; Category: RES; Price1k: 0.2; Supplier: TME; Temperature: -55 to + 155 stC; Tolerance: 5%; Type: SMD; Value: 2mR shunt; Supplier 1: FARNELL
R4 = RES_105k_5p_0603: Resistor 0603 5% 0,1W; Voltage: 50; Category: RES; Price1k: 0.003; Price10: 0.01; Supplier: TME; Temperature: -55 to + 125 stC; Tolerance: 5%; Type: SMD; Value: 240k; Supplier 1: TME
R5 = RES_62k_5p_0603: Resistor 0603 5% 0,1W; Manufacturer: YAGEO; Eng.: W.Bledzinski 14.05.2014; Voltage: 50; Category: RES; Price1k: 0.003; Price10: 0.01; Supplier: TME; Temperature: -55 to + 125 stC; Tolerance: 5%; Type: SMD; Value: 120k; Supplier 1: Farnell
R6 R8-R11 R22 R23 R37 R38 R47 R49 R52 R54 R65 = RES_1k_5p_0603: Resistor 0603 5% 0,1W; Manufacturer: YAGEO; Eng.: W.Bledzinski 12.06.2015; Voltage: 50; Category: RES; Price1k: 0.003; Price10: 0.01; Supplier: TME; Temperature: -55 to + 125 stC; Tolerance: 5%; Type: SMD; Supplier 1: TME
  R6 R37: Value: 470k
  R8-R11 R38 R47 R49 R52 R54 R65: Supplier Part Number: SMD0603-1K; Value: 1k 5%; Supplier Part Number 1: SMD0603-1K
  R22 R23: Value: 49.9k
R7 R14 R40 R43-R46 R56 R57 = RES_16k_5p_0603: Resistor 0603 5% 0,1W; Manufacturer: YAGEO; Voltage: 50; Category: RES; Price1k: 0.003; Price10: 0.01; Supplier: TME; Temperature: -55 to + 125 stC; Tolerance: 5%; Type: SMD; Supplier 1: TME
  R7 R43-R46 R56 R57: Value: 10k
  R14 R40: Value: 16k 5%
R12 R13 R24 R27 R29-R33 R35 R39 R48 R51 R55 R58 R62 R63 R67 = RES_10k_5p_0603: Resistor 0603 5% 0,1W; Voltage: 50; Category: RES; Price1k: 0.003; Price10: 0.01; Tolerance: 5%; Type: SMD; Value: 10k 5%
R15 = RES_510_5p_0603: Resistor 0603 5% 0,1W; Eng.: W.Bledzinski 23.06.2015; Voltage: 50; Category: RES; Price1k: 0.003; Price10: 0.01; Supplier: TME; Supplier Part Number: SMD0603-510R; Temperature: -55 to + 125 stC; Tolerance: 5%; Type: SMD; Value: 510 5%; Supplier 1: TME; Supplier Part Number 1: SMD0603-510R
R16 R34 R36 R64 R70 = RES_100k_5p_0603: Resistor 0603 5% 0,1W; Voltage: 50; Category: RES; Price1k: 0.003; Price10: 0.01; Supplier: TME; Temperature: -55 to + 125 stC; Tolerance: 5%; Type: SMD; Supplier 1: TME
  R16 R70: Value: 100k 5%
  R34 R64: Value: 220k
  R36: Value: 4k7
R17 R69 = RES_47k_5p_0603: Resistor 0603 5% 0,1W; Manufacturer: YAGEO; Eng.: W.Bledzinski 12.06.2015; Voltage: 50; Category: RES; Price1k: 0.003; Price10: 0.01; Supplier: TME; Supplier Part Number: SMD0603-47K; Temperature: -55 to + 125 stC; Tolerance: 5%; Type: SMD; Value: 47k 5%; Supplier 1: TME; Supplier Part Number 1: SMD0603-47K
R18 = RES_20k_5p_0603: Resistor 0603 5% 0,1W; Manufacturer: ROYAL OHM; Manufacturer Part Number: 0603SAJ0203T5E; Eng.: W.Bledzinski 30.04.2014; Voltage: 50; Category: RES; Price1k: 0.003; Price10: 0.01; Supplier: TME; Supplier Part Number: SMD0603-20K; Temperature: -55 to + 125 stC; Tolerance: 5%; Type: SMD; Value: 20k 5%; Supplier 1: Farnell; Supplier Part Number 1: 1799402
R19 R20 = RES_22k_5p_0603: Resistor 0603 5% 0,1W; Manufacturer: YAGEO; Eng.: W.Bledzinski 12.06.2015; Voltage: 50; Category: RES; Price1k: 0.003; Price10: 0.01; Supplier: TME; Supplier Part Number: SMD0603-22K; Temperature: -55 to + 125 stC; Tolerance: 5%; Type: SMD; Value: 22k 5%; Supplier 1: TME; Supplier Part Number 1: SMD0603-22K
R21 = RES_100k_5p_0603: Resistor 0603 5% 0,1W; Eng.: W.Bledzinski 12.03.2016; Voltage: 50; Category: RES; Price1k: 0.003; Price10: 0.01; Supplier: TME; Temperature: -55 to + 125 stC; Tolerance: 5%; Type: SMD; Value: 100k 5%; Supplier 1: TME
R25 R26 R66 R72 = RES_4M7_5p_1206: Resistor 1206 5% 0,25W; Manufacturer: ROYAL OHM; Manufacturer Part Number: 1206S4J0475T5E; Eng.: W.Bledzinski 11.02.2014; Voltage: 200; Category: RES; Price1k: 0.004; Price10: 0.009; Supplier: TME; Supplier Part Number: SMD1206-4M7; Temperature: -55 to + 125 stC; Tolerance: 5%; Type: SMD; Value: 4M7 5%
R28 R41 R42 R53 R71 = RES_330R_5p_0603: Resistor 0603 5% 0,1W; Eng.: W.Bledzinski 10.12.2015; Voltage: 50; Category: RES; Price1k: 0.003; Price10: 0.01; Supplier: TME; Supplier Part Number: SMD0603-330R; Temperature: -55 to + 125 stC; Tolerance: 5%; Type: SMD; Value: 330 5%; Supplier 1: TME; Supplier Part Number 1: SMD0603-330R
R50 = RES_10k_5p_0603: Resistor 0603 5% 0,1W; Value: 10k 5%; Voltage: 50; Category: RES; Price1k: 0.003; Price10: 0.01; Tolerance: 5%; Type: SMD
R61 = RES_68_5p_0603: 0603 ,1W; Manufacturer: ROYAL OHM; Manufacturer Part Number: 0603SAJ0680T5E; Eng.: W.Bledzinski 20.01.2014; Category: RES; Price1k: 0.003; Price10: 0.09; Supplier: TME; Supplier Part Number: SMD0603-68R; Temperature: -55 to + 125 stC; Tolerance: 5%; Type: SMD; Value: 68 5%
R68 = RES_16k_5p_0603: Resistor 0603 5% 0,1W; Manufacturer: YAGEO; Value: 10k; Voltage: 50; Category: RES; Price1k: 0.003; Price10: 0.01; Supplier: TME; Temperature: -55 to + 125 stC; Tolerance: 5%; Type: SMD; Supplier 1: TME
RT1-RT3 = REST_10k_0603: Thermistor 0603 ,063W Stała materiałowa B     3985K; Manufacturer: VISHAY; Manufacturer Part Number: NTCS0603E3683FHT; Price1k: 0.2; Price10: 0.3; Supplier: TME; Supplier Part Number: NTCS0603E3683FHT; Temperature: -55 to + 125 stC; Type: SMD; Value: NTCS0603E3683FHT; Supplier 1: TME; Supplier Part Number 1: NTCS0603E3683FHT
RV1 = RESV_38V_1kA_THT: warystor S14 30VAC 38VDC 1kA 9J@2ms; Manufacturer: EPCOS; Eng.: W.Bledzinski 18.05.2015; Tolerance: 10%; Category: VAR; Price1k: 0.38; Price10: 0.83; Supplier: TME; Supplier Part Number: SIOV-S14K60; Temperature: -55 to + 125 stC; Type: THT; Value: 50VAC 1kA; Supplier 1: TME; Supplier Part Number 1: SIOV-S14K30
T1-T4 T6 T7 T12-T14 = T_IPD034N06N3: 60V N-Mosfet 100A 60V 3.54mohm; Manufacturer: INFINEON; Type: SMD; Rds On (Max) @ Id, Vgs: 3.4 mOhm @ 100A, 10V; Vgs (Max): ±20V; Vgs(th) (Max) @ Id: 4V @ 93µA; Drive Voltage (Max Rds On,  Min Rds On): 10V; Current - Continuous Drain (Id) @ 25°C: 100A (Tc); Category: TRANSISTOR; Manufacturer Part Number: IPD034N06N3GATMA1; Operating Temperature: -55°C ~ 175°C (TJ); Drain-source voltage: 60V; Supplier 2: Farnell; Pricing: 1=1.2696, 3=1.0935, 10=0.8782, 100=0.7623, 1000=0.7097 (USD); Supplier Part Number 1: IPD034N06N3GATMA1; Supplier Part Number 2: 2443392RL; Supplier: TME; Supplier 1: TME; Supplier Part Number: IPD034N06N3GATMA1
T5 T8-T10 T15 T16 = T_2N7002: 60V 0.21A N mosfet; Manufacturer: DIODES; Type: SMD; Manufacturer Part Number: 2N7002-7-F; Supplier: TME; Supplier Part Number: 2N7002-7-F; Temperature: -55 to + 150 stC; Value: 2N7002-7-F; Voltage: 60V; Supplier 1: TME; Supplier Part Number 1: 2N7002-7-F
T11 = T_HCPL817-300E: HCPL817-300E / '0' ctr 50-600% / if 20ma ic 30ma vce 70V vr 4v; Manufacturer Part Number: HCPL-817-36BE; Type: SMD; Dark Current-Max: 100nA; Forward Current-Max: 50mA; Isolation Voltage-Max: 5kV; Forward Voltage-Max: 1.4V; On-State Current-Max: 30mA; Coll-emtr Bkdn Voltage-Min: 70V; Supplier 1: Farnell; Supplier Part Number 1: 1244566
U1 = IC_TPS57160QDGQRQ1: 116uA quescient current; Manufacturer: Texas Instruments; Voltage - Input (Max): 60V; Current - Output: 1.5A; Frequency - Switching: 100kHz ~ 2.5MHz; Supplier 1: Farnell; Supplier 2: Avnet; Pricing: 1=3.02, 10=2.716, 100=2.225, 500=1.89414, 1000=1.59747 (GBP); Supplier Part Number 1: 2492454; Supplier Part Number 2: TPS57160QDGQRQ1; Manufacturer Part Number: TPS57160QDGQRQ1; Operating Temperature: -40°C ~ 125°C (TA)
U2 = IC_LMV772QMM: LowOffset,LowNoise,RROOperationalAmplifier; Manufacturer: TI National Semiconductor; Max Supply Voltage: 5.5V; Min Supply Voltage: 2.7V; Gain Bandwidth Product: 3.5MHz; Operating Supply Current: 600uA; Manufacturer Part Number: LMV772QMM/NOPB; Min Operating Temperature: -40°C; Max Operating Temperature: 125°C; Supplier Part Number 1: 926-LMV772QMM/NOPB; Supplier 1: Mouser; Supplier Unit Price 1: $2.66
U3 = MOD_WT8266-S2: Manufacturer: xiaoe; Current: 215mA; Eng.: W.Bledzinski 29.09.2016; Voltage: 3.0 - 3.6; Category: MODULE; Manufacturer Part Number: WT8266-S2; Price1k: 6; Price10: 8; Supplier 1: TME; Supplier: maritex; Supplier Part Number 1: WT8266-S2; Supplier Part Number: WIFI-WT8266-S2; Temperature: -40 to +85 stC; Type: SMD; Value: WT8266-S2
U4 = IC_MCP1825S-3.3_SOT223: LDO=210mV 6V DC max, Iq 120uA, Cout 1u ceramic; Manufacturer: Microchip; Current: 500mA; Category: IC; Manufacturer Part Number: MCP1703A-3302; Price1k: 0.75; Price10: 1; Supplier: TME; Supplier Part Number: MCP1825S-3302ED; Type: SMD; Value: MCP1703A-3302; Voltage: 6V; Supplier 1: Farnell
U5 = IC_STM32L431RCT6_LQFP64: LQFP64, 10x10mm; Manufacturer: STMicroelectronics; Supplier Unit Price 1: $3.52; Case/Package: LQFP; Supplier 1: Arrow; Supplier 2: TME; Supplier Part Number 2: STM32L431RCT6; Supplier Part Number 1: STM32L431RCT6
X1 = OSCX_8M_5,0x3,2: SMD 5,0x3,2mm xtal drive 100uW max; ESR 150 ohm; Manufacturer: Abracon; Frequency Tolerance: 20ppm; Frequency Stability: 30ppm; Frequency: 8MHz; ESR (Equivalent Series Resistance): 500R; Category: OSC; Type: SMD; Max Operating Temperature: 85°C; Depth: 3.2mm; Composition: Ceramic; Min Operating Temperature: -40°C; Width: 3.2mm; Supplier Unit Price 1: $0.52632